# EAGLE schematic projet-elec-eagle (EAGLE 9.5.2)
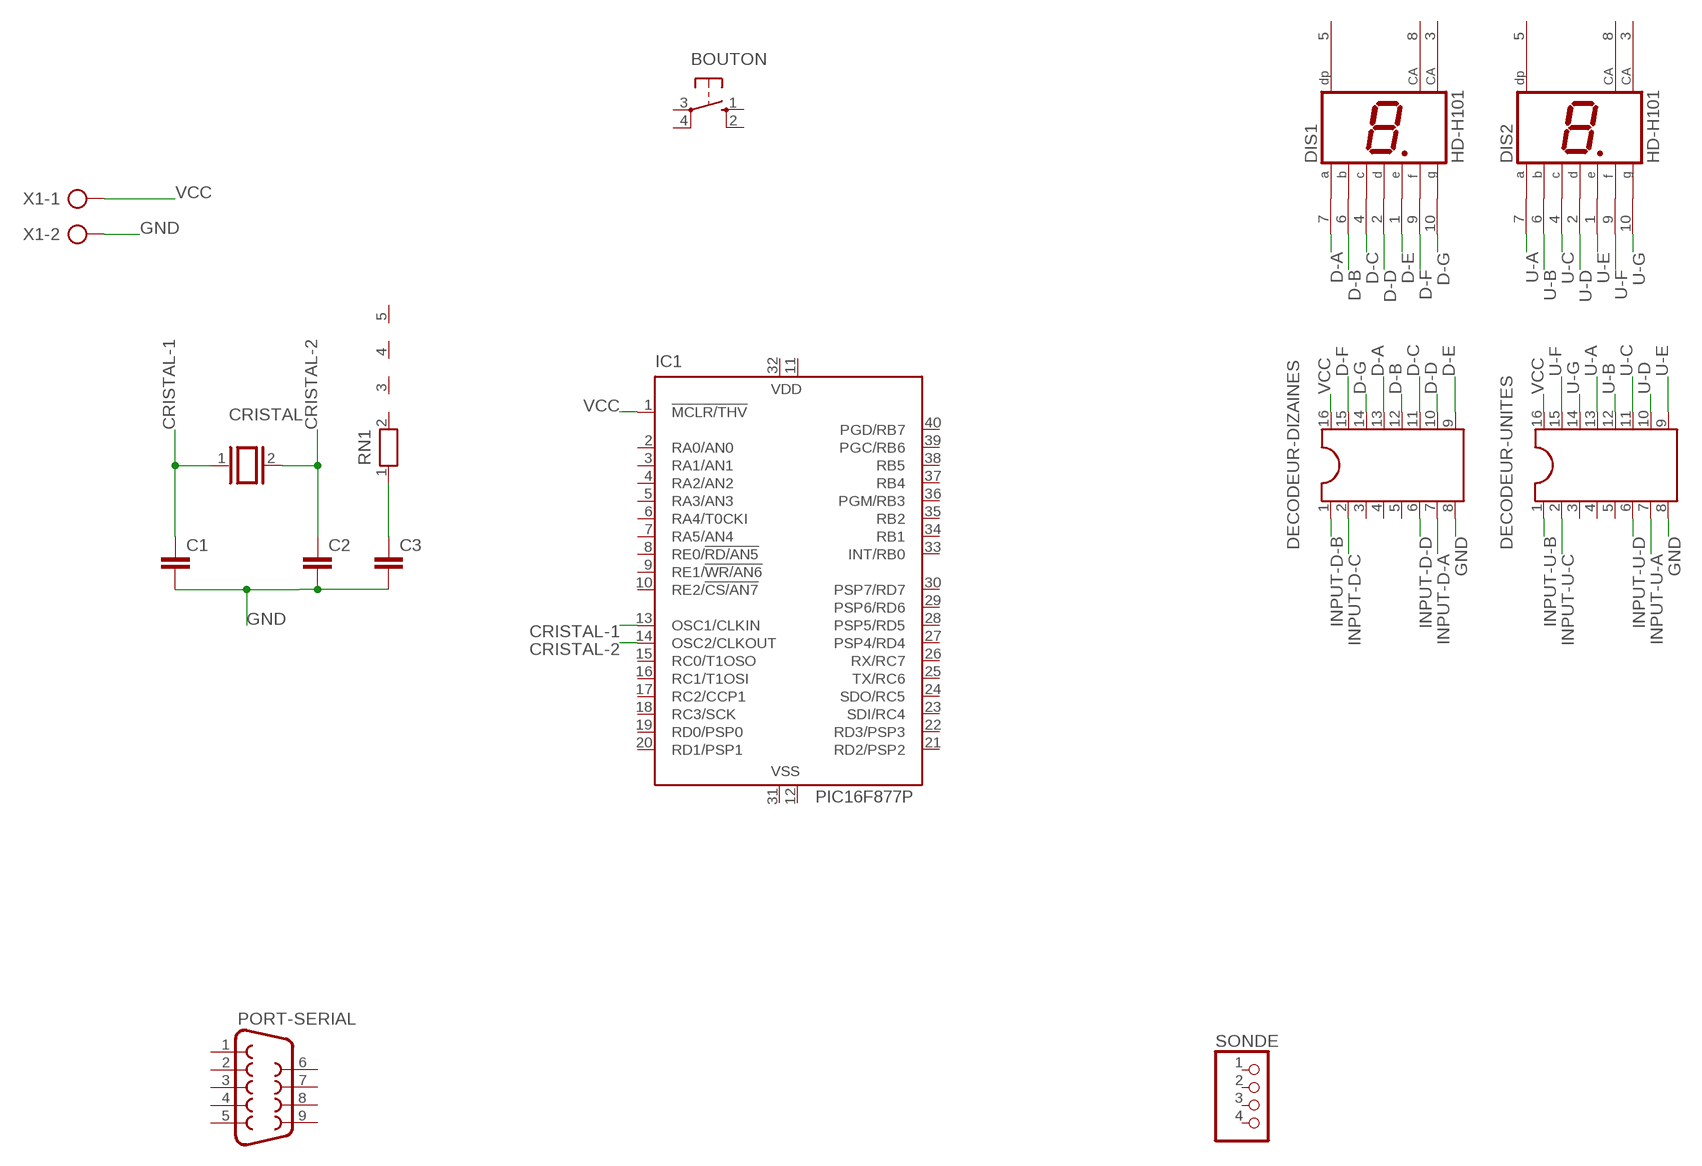
[diagram p0: schematic, sheet 1]

## Parts
BOUTON  10-XX  [B3F-10XX]
C1  C-EU025-025X050  [C025-025X050]
C2  C-EU025-025X050  [C025-025X050]
C3  C-EU025-025X050  [C025-025X050]
CRISTAL  XTAL/S  [QS]
DECODEUR-DIZAINES  DIL16S  [SOCKET-16]
DECODEUR-UNITES  DIL16S  [SOCKET-16]
DIS1  HD-H101  [HDSP-M]
DIS2  HD-H101  [HDSP-M]
IC1  PIC16F877P  [DIL40]
PORT-SERIAL  F09HP  [F09HP]
RN1  RN04  [RN-5]
SONDE  PINHD-1X4  [1X04]
X1  AK500/2-H  [AK500/2-H]

## Nets
CRISTAL-1: C1.1 CRISTAL.1 IC1.13(OSC1/CLKIN)
CRISTAL-2: C2.1 CRISTAL.2 IC1.14(OSC2/CLKOUT)
D-A: DECODEUR-DIZAINES.13 DIS1.7(A)
D-B: DECODEUR-DIZAINES.12 DIS1.6(B)
D-C: DECODEUR-DIZAINES.11 DIS1.4(C)
D-D: DECODEUR-DIZAINES.10 DIS1.2(D)
D-E: DECODEUR-DIZAINES.9 DIS1.1(E)
D-F: DECODEUR-DIZAINES.15 DIS1.9(F)
D-G: DECODEUR-DIZAINES.14 DIS1.10(G)
GND: C1.2 C2.2 C3.2 DECODEUR-DIZAINES.8 DECODEUR-UNITES.8 X1.2
INPUT-D-A: DECODEUR-DIZAINES.7
INPUT-D-B: DECODEUR-DIZAINES.1
INPUT-D-C: DECODEUR-DIZAINES.2
INPUT-D-D: DECODEUR-DIZAINES.6
INPUT-U-A: DECODEUR-UNITES.7
INPUT-U-B: DECODEUR-UNITES.1
INPUT-U-C: DECODEUR-UNITES.2
INPUT-U-D: DECODEUR-UNITES.6
N$4: C3.1 RN1.1
U-A: DECODEUR-UNITES.13 DIS2.7(A)
U-B: DECODEUR-UNITES.12 DIS2.6(B)
U-C: DECODEUR-UNITES.11 DIS2.4(C)
U-D: DECODEUR-UNITES.10 DIS2.2(D)
U-E: DECODEUR-UNITES.9 DIS2.1(E)
U-F: DECODEUR-UNITES.15 DIS2.9(F)
U-G: DECODEUR-UNITES.14 DIS2.10(G)
VCC: DECODEUR-DIZAINES.16 DECODEUR-UNITES.16 IC1.1(!MCLR/THV) X1.1
Unconnected: BOUTON.1(S) BOUTON.2(S1) BOUTON.3(P) BOUTON.4(P1) DECODEUR-DIZAINES.3 DECODEUR-DIZAINES.4 DECODEUR-DIZAINES.5 DECODEUR-UNITES.3 DECODEUR-UNITES.4 DECODEUR-UNITES.5 DIS1.3(CA) DIS1.5(DP) DIS1.8(CA) DIS2.3(CA) DIS2.5(DP) DIS2.8(CA) IC1.2(RA0/AN0) IC1.3(RA1/AN1) IC1.4(RA2/AN2) IC1.5(RA3/AN3) IC1.6(RA4/T0CKI) IC1.7(RA5/AN4) IC1.8(RE0/!RD/AN5) IC1.9(RE1/!WR/AN6) IC1.10(RE2/!CS/AN7) IC1.15(RC0/T1OSO) IC1.16(RC1/T1OSI) IC1.17(RC2/CCP1) IC1.18(RC3/SCK) IC1.19(RD0/PSP0) IC1.20(RD1/PSP1) IC1.21(RD2/PSP2) IC1.22(RD3/PSP3) IC1.23(SDI/RC4) IC1.24(SDO/RC5) IC1.25(TX/RC6) IC1.26(RX/RC7) IC1.27(PSP4/RD4) IC1.28(PSP5/RD5) IC1.29(PSP6/RD6) IC1.30(PSP7/RD7) IC1.33(INT/RB0) IC1.34(RB1) IC1.35(RB2) IC1.36(PGM/RB3) IC1.37(RB4) IC1.38(RB5) IC1.39(PGC/RB6) IC1.40(PGD/RB7) PORT-SERIAL.1 PORT-SERIAL.2 PORT-SERIAL.3 PORT-SERIAL.4 PORT-SERIAL.5 PORT-SERIAL.6 PORT-SERIAL.7 PORT-SERIAL.8 PORT-SERIAL.9 RN1.2 RN1.3 RN1.4 RN1.5 SONDE.1 SONDE.2 SONDE.3 SONDE.4

## Power pins joined to a net without a drawn wire
VDD: IC1.11(VDD) IC1.32(VDD)
VSS: IC1.12(VSS) IC1.31(VSS)

## Library data of the parts
BOUTON = switch-omron:10-XX: OMRON SWITCH; MPN: B3F-1000; OC_FARNELL: 176432; OC_NEWARK: 36M3542
C1-C3 = rcl:C-EU: CAPACITOR, European symbol; SPICEPREFIX: C
CRISTAL = special:XTAL/S: CRYSTAL
DECODEUR-DIZAINES = ic-package:DIL16: Dual In Line / Socket; SPICEPREFIX: X
DECODEUR-UNITES = ic-package:DIL16: Dual In Line / Socket
DIS1 DIS2 = display-hp:HD-H101: LED DISPLAY 1-character 7 segment, decimal point right; OC_FARNELL: unknown; OC_NEWARK: unknown
IC1 = microchip:PIC16F87*: MICROCONTROLLER; MF: MICROCHIP; MPN: PIC16F877-04/P; OC_FARNELL: 9761349; OC_NEWARK: 61K3463
PORT-SERIAL = con-subd:F09: SUB-D; OC_FARNELL: unknown; OC_NEWARK: unknown
RN1 = resistor-net:RN04: RESISTOR NETWORK; OC_FARNELL: unknown; OC_NEWARK: unknown
SONDE = pinhead:PINHD-1X4: PIN HEADER
X1 = con-ptr500:AK500/2-H: CONNECTOR Aug. 2004 / PTR Meßtechnik: Die Bezeichnung der Serie AK505 wurde geändert. Es handelt sich hierbei um AK500 in horizontaler Ausführung.; OC_FARNELL: unknown; OC_NEWARK: unknown